# Altium schematic sheet Adafruit Feather M0 Basic rev C.SchDoc
size 282 x 200 mm; COMPANY: ADAFRUIT INDUSTRIES; DRAWN: KTOWN; REV: B
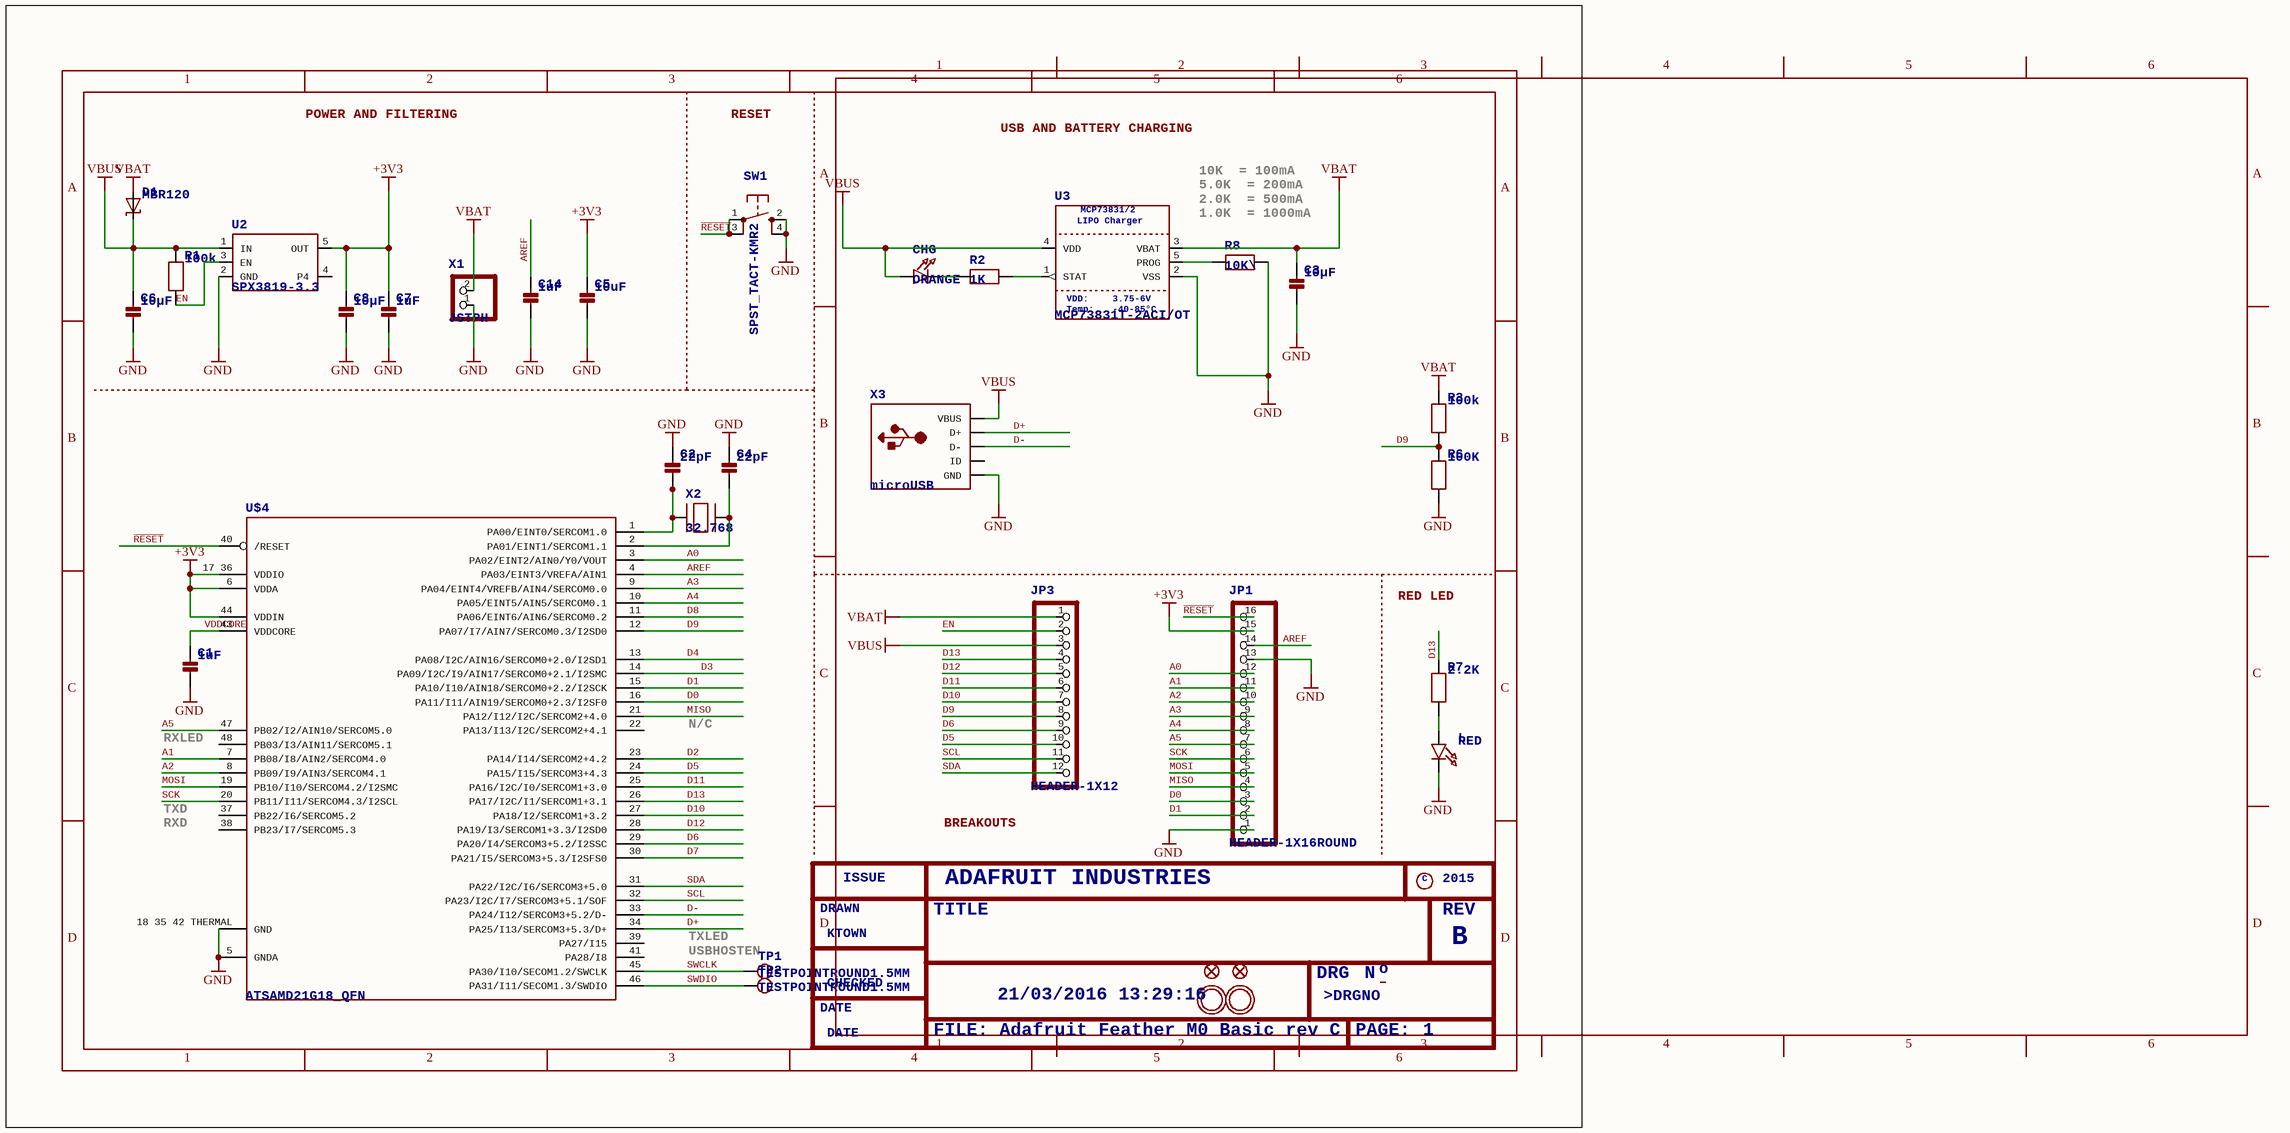
[diagram p0: Adafruit Feather M0 Basic rev C.SchDoc]

## Parts
C1  1uF  [0603-NO]
C2  22pF  [0603-NO]
C3  10µF  [0805-NO]
C4  22pF  [0603-NO]
C5  10uF  [0805-NO]
C6  10µF  [0805-NO]
C7  1uF  [0603-NO]
C8  10µF  [0805-NO]
C14  1uF  [0603-NO]
CHG  ORANGE  [CHIPLED_0805_NOOUTLINE]
D1  MBR120  [SOD-123]
FRAME1  FRAME_A4  (value not drawn)  (parts A,B of 2)
JP1  HEADER-1X16ROUND  [1X16_ROUND]
JP3  HEADER-1X12  [1X12_ROUND]
L  RED  [CHIPLED_0805_NOOUTLINE]
R1  100k  [0603-NO]
R2  1K  [0603-NO]
R3  100k  [0603-NO]
R6  100K  [0603-NO]
R7  2.2K  [0603-NO]
R8  10K\  [0603-NO]
SW1  SPST_TACT-KMR2  [KMR2]
TP1  TESTPOINTROUND1.5MM  [TESTPOINT_ROUND_1.5MM]
TP2  TESTPOINTROUND1.5MM  [TESTPOINT_ROUND_1.5MM]
U2  SPX3819-3.3  [SOT23-5]
U3  MCP73831T-2ACI/OT  LIPOCharger: LIPO Charger  Temp: Temp:  VDD: VDD:  [SOT23-5]
U$4  ATSAMD21G18_QFN  [TQFN48_7MM]
U$31  MOUNTINGHOLE2.5  [MOUNTINGHOLE_2.5_PLATED]  (value not drawn)
U$32  MOUNTINGHOLE2.5  [MOUNTINGHOLE_2.5_PLATED]  (value not drawn)
U$34  FIDUCIAL""  [FIDUCIAL_1MM]  (value not drawn)
U$35  FIDUCIAL""  [FIDUCIAL_1MM]  (value not drawn)
X1  JSTPH  [JSTPH2]
X2  32.768  [XTAL3215]
X3  microUSB  [4UCONN_20329_V2]

## Nets
+3V3: C5.1 C7.1 C8.1 JP1.15 U2.5(OUT) U$4.6(VDDA) U$4.17_36(VDDIO) U$4.44(VDDIN)
GND: C1.2 C2.2 C3.2 C4.2 C5.2 C6.2 C7.2 C8.2 C14.2 JP1.1 JP1.13 L.C R6.2 R8.2 SW1.2(S) SW1.4(S1) U2.2(GND) U3.2(VSS) U$4.5(GNDA) U$4.18_35_42_THERMAL(GND) X1.1 X3.BASE@1_BASE@2_GND_SPRT@1_SPRT@2_SPRT@3_SPRT@4(GND)
VBAT: C3.1 D1.A JP3.1 R3.1 U3.3(VBAT) X1.2
VBUS: C6.1 CHG.A D1.C JP3.3 R1.1 U2.1(IN) U3.4(VDD) X3.VBUS
A0: JP1.12 U$4.3(PA02/EINT2/AIN0/Y0/VOUT)
A1: JP1.11 U$4.7(PB08/I8/AIN2/SERCOM4.0)
A2: JP1.10 U$4.8(PB09/I9/AIN3/SERCOM4.1)
A3: JP1.9 U$4.9(PA04/EINT4/VREFB/AIN4/SERCOM0.0)
A4: JP1.8 U$4.10(PA05/EINT5/AIN5/SERCOM0.1)
A5: JP1.7 U$4.47(PB02/I2/AIN10/SERCOM5.0)
AREF: C14.1 JP1.14 U$4.4(PA03/EINT3/VREFA/AIN1)
D0: JP1.3 U$4.16(PA11/I11/AIN19/SERCOM0+2.3/I2SF0)
D1: JP1.2 U$4.15(PA10/I10/AIN18/SERCOM0+2.2/I2SCK)
D2: U$4.23(PA14/I14/SERCOM2+4.2)
D3: U$4.14(PA09/I2C/I9/AIN17/SERCOM0+2.1/I2SMC)
D4: U$4.13(PA08/I2C/AIN16/SERCOM0+2.0/I2SD1)
D5: JP3.10 U$4.24(PA15/I15/SERCOM3+4.3)
D6: JP3.9 U$4.29(PA20/I4/SERCOM3+5.2/I2SSC)
D7: U$4.30(PA21/I5/SERCOM3+5.3/I2SFS0)
D8: U$4.11(PA06/EINT6/AIN6/SERCOM0.2)
D9: JP3.8 R3.2 R6.1 U$4.12(PA07/I7/AIN7/SERCOM0.3/I2SD0)
D10: JP3.7 U$4.27(PA18/I2/SERCOM1+3.2)
D11: JP3.6 U$4.25(PA16/I2C/I0/SERCOM1+3.0)
D12: JP3.5 U$4.28(PA19/I3/SERCOM1+3.3/I2SD0)
D13: JP3.4 R7.1 U$4.26(PA17/I2C/I1/SERCOM1+3.1)
D+: U$4.34(PA25/I13/SERCOM3+5.3/D+) X3.D+
D-: U$4.33(PA24/I12/SERCOM3+5.2/D-) X3.D-
EN: JP3.2 R1.2 U2.3(EN)
MISO: JP1.4 U$4.21(PA12/I12/I2C/SERCOM2+4.0)
MOSI: JP1.5 U$4.19(PB10/I10/SERCOM4.2/I2SMC)
~{RESET}: JP1.16 SW1.1(P) SW1.3(P1) U$4.40(/RESET)
SCK: JP1.6 U$4.20(PB11/I11/SERCOM4.3/I2SCL)
SCL: JP3.11 U$4.32(PA23/I2C/I7/SERCOM3+5.1/SOF)
SDA: JP3.12 U$4.31(PA22/I2C/I6/SERCOM3+5.0)
SWCLK: TP1.P$1 U$4.45(PA30/I10/SECOM1.2/SWCLK)
SWDIO: TP2.P$1 U$4.46(PA31/I11/SECOM1.3/SWDIO)
VDDCORE: C1.1 U$4.43(VDDCORE)
NetC2_1: C2.1 U$4.1(PA00/EINT0/SERCOM1.0) X2.P$1
NetC4_1: C4.1 U$4.2(PA01/EINT1/SERCOM1.1) X2.P$2
NetCHG_C: CHG.C R2.1
NetL_A: L.A R7.2
NetR2_2: R2.2 U3.1(STAT)
NetR8_1: R8.1 U3.5(PROG)

Not connected (* = marked no-connect by the designer): U2 4(P4); U$4 22(PA13/I13/I2C/SERCOM2+4.1) 37(PB22/I6/SERCOM5.2) 38(PB23/I7/SERCOM5.3) 39(PA27/I15) 41(PA28/I8) 48(PB03/I3/AIN11/SERCOM5.1); X3 ID

## Notes on the sheet
- POWER AND FILTERING
- RESET
- USB AND BATTERY CHARGING
- 10K  = 100mA
- 5.0K  = 200mA
- 2.0K  = 500mA
- 1.0K  = 1000mA
- RED LED
- N/C
- RXLED
- TXD
- RXD
- BREAKOUTS
- TXLED
- USBHOSTEN
- (in symbol FRAME_A4, part A) 1; 2; 3; 4; 5; 6; A; C; D
- (in symbol FRAME_A4, part B) 2; 3; 4; 5; 6; A; D

## Library data of the parts
C1 C2 C4 C7 C14 = CAP_CERAMIC0603_NO: Ceramic Capacitors   For new designs, use the packages preceded by an '_' character since they are more reliable:   The following footprints should be used on most boards: _0402 - Standard footprint for regular board layouts  _0603 - Standard footprint for regular board layouts  _0805 - Standard footprint for regular board layouts  _1206 - Standard footprint for regular board layouts       For extremely tight-pitch boards where space is at a premium, the following 'micro-pitch' footprints can be used (smaller pads, no silkscreen outline, etc.): _0402MP - Micro-pitch footprint for very dense/compact boards  _0603MP - Micro-pitch footprint for very dense/compact boards  _0805MP - Micro-pitch footprint for very dense/compact boards  _1206MP - Micro-pitch footprint for very dense/compact boards; COMPANY: ADAFRUIT INDUSTRIES; DRAWN: KTOWN; REV: B
C3 C5 C6 C8 = CAP_CERAMIC0805-NOOUTLINE: Ceramic Capacitors   For new designs, use the packages preceded by an '_' character since they are more reliable:   The following footprints should be used on most boards: _0402 - Standard footprint for regular board layouts  _0603 - Standard footprint for regular board layouts  _0805 - Standard footprint for regular board layouts  _1206 - Standard footprint for regular board layouts       For extremely tight-pitch boards where space is at a premium, the following 'micro-pitch' footprints can be used (smaller pads, no silkscreen outline, etc.): _0402MP - Micro-pitch footprint for very dense/compact boards  _0603MP - Micro-pitch footprint for very dense/compact boards  _0805MP - Micro-pitch footprint for very dense/compact boards  _1206MP - Micro-pitch footprint for very dense/compact boards; COMPANY: ADAFRUIT INDUSTRIES; DRAWN: KTOWN; REV: B
CHG L = LED0805_NOOUTLINE: LED0603 - 0603 Surface Mount Package    2mA: Green LED - Low Power (3.9mcd, 2ma, 1.7Vf) - Digikey: 475-2709-2-ND  Orange LED - Low Power (9.8mcd, 2ma, 1.8Vf) - Digikey: 475-1194-2-ND  Red LED - Low Power (5mcd, 2ma, 1.8Vf) - Digikey: 475-1195-2-ND  Yellow LED - Low Power (7mcd, 2ma, 1.8Vf) - Digikey: 475-1196-2-ND       5mA: Blue LED - Low Power (17mcd, 5ma, 2.9Vf) - Digikey: LNJ937W8CRACT-ND    0805 - 0805 Surface Mount Package    2mA: Red LED (8.8mcd, 2mA, 1.8Vf, Clear) - Low Power [Digikey: 475-2510-1-ND]  Green LED (5mcd, 2mA, 1.8Vf, Clear) - Low Power [Digikey: 475-2730-1-ND]  Yellow LED (11.3mcd, 2mA, 1.8Vf, Clear) - Low Power [Digikey: 475-2555-1-ND]       20mA: Red LED (104mcd, 20mA, Diffused) - LS R976 [Digikey: 475-1278-6-ND]  Red LED (12mcd, 20mA, 2.0Vf, Clear) - APT2012EC [Digikey: 754-1128-1-ND]  Green LED (15mcd, 20mA, 2.2Vf, Clear) - APT2012GC [Digikey: 754-1131-1-ND]  Orange LED (160mcd, 20mA, 2.1Vf, Clear) - APT2012SECK [Digikey: 754-1130-1-ND]     1206 - 1206 Surface Mount Package  Green LED (26mcd, 20mA, Diffused) - LG N971  [Digikey: 475-1407-6-ND]  Red LED (15mcd, 20mA, Diffused) - LH N974 [Digikey: 475-1416-6-ND]     Cree - Cree High-Power Surface Mount LEDs  XPEBWT-L1-0000-00D50 - White 111lm 350mA 2.9Vf 6200K 110°  XTEAWT-00-0000-00000LEE3 - White 114lm 350mA 2.85Vf 5000K 115°     Everlight - Everlight 45-21 Series Surface Mount LEDs  45-21/QK2C-B2832AC2CB2/2T - Warm White 2000mcd 20mA 3.25Vf 3050K 120°  45-21/LK2C-B38452C4CB2/2T - Nuetral White 2000mcd 20mA 3.25Vf 4150K 120°  45-21/LK2C-B50634C6CB2/2T - Cold White 2200mcd 20mA 3.25Vf 5650K 120°     PLCC2 Reverse Mount LS T77K-J1L2-1-0-2-R18-Z - Red 11.25mcd 2mA 1.8Vf 630nm 120°  LO T77K-L1M2-24-Z - Orange 19.6mcd 2mA 1.8Vf 606nm 120°  LY T77K-K2M1-26-Z - Yellow 15.7mcd 2mA 1.8Vf 587nm 120°; COMPANY: ADAFRUIT INDUSTRIES; DRAWN: KTOWN; REV: B
D1 = DIODE-SCHOTTKYSOD-123: COMPANY: ADAFRUIT INDUSTRIES; DRAWN: KTOWN; REV: B
FRAME1 = FRAME_A4: FRAME   DIN A4, landscape with location and doc. field; COMPANY: ADAFRUIT INDUSTRIES; DRAWN: KTOWN; REV: B
JP1 = HEADER-1X16ROUND: PIN HEADER; COMPANY: ADAFRUIT INDUSTRIES; DRAWN: KTOWN; REV: B
JP3 = HEADER-1X12: COMPANY: ADAFRUIT INDUSTRIES; DRAWN: KTOWN; REV: B
R1-R3 R6-R8 = RESISTOR_0603_NOOUT: Resistors   For new designs, use the packages preceded by an '_' character since they are more reliable:   The following footprints should be used on most boards: _0402 - Standard footprint for regular board layouts  _0603 - Standard footprint for regular board layouts  _0805 - Standard footprint for regular board layouts  _1206 - Standard footprint for regular board layouts       For extremely tight-pitch boards where space is at a premium, the following 'micro-pitch' footprints can be used (smaller pads, no silkscreen outline, etc.): _0402MP - Micro-pitch footprint for very dense/compact boards  _0603MP - Micro-pitch footprint for very dense/compact boards  _0805MP - Micro-pitch footprint for very dense/compact boards  _1206MP - Micro-pitch footprint for very dense/compact boards; COMPANY: ADAFRUIT INDUSTRIES; DRAWN: KTOWN; REV: B
SW1 = SPST_TACT-KMR2: SMT 6mm switch, EVQQ2 series    http://www.ladyada.net/library/eagle
TP1 TP2 = TESTPOINTROUND1.5MM: Test Point   Various test points for characterisation and PCB testing    TESTPOINT_SMT - Compact Surface Mount Test Point [Digikey: 5016KTR-ND]; COMPANY: ADAFRUIT INDUSTRIES; DRAWN: KTOWN; REV: B
U2 = VREG_SOT23-5: SOT23-5 Fixed Voltage Regulators      Part	Current Out	V Out	V In	V Dropout	θJA (°C/W)	TJ (°C)	Digikey Part No.	     ADP121	  150mA	  3.3V	  3.4-5.5V	  0.09V @ 150mA	  --	  --	  ADP121-AUJZ33R7CT-ND	     ADP121	  150mA	  3.0V	  3.1-5.5V	  0.09V @ 150mA	  --	  --	  ADP121-AUJZ30R7CT-ND	     ADP122	  300mA	  3.3V	  3.4-5.5V	  0.085V @ 300mA	  --	  --	  ADP122AUJZ-3.3-R7CT-ND	     ADP1712	  300mA	  3.3V	  3.5-5.5V	  0.17V @ 300mA	  --	  --	  ADP1712AUJZ-3.3-R7TR-ND	     AP7311 (Low Cost)	  150mA	  3.3V	  3.5-6V	  0.15V @ 150mA	  --	  --	  AP7311-33WG-7DICT-ND	     LD39015M18R	  150mA	  1.8V	  1.9V-5.5V	  0.08V @ 100mA	  --	  --	  497-6977-1-ND	     LP2985A-33DBVR	  150mA	  3.3V	  3.3-16V	  0.28V @ 150mA	  206	  150	  296-18479-1-ND	     MCP1824T-3302E/OT	  300mA	  3.3V	  3.5V-6V	  0.2V @ 300mA	  --	  --	  MCP1824T-3302E/OTCT-ND	     MIC5205-2.5YM5 TR	  150mA	  2.5V	  2.7-16V	  0.165V @ 150mA	  --	  --	  576-1257-2-ND	     MIC5205-3.0YM5 TR	  150mA	  3.0V	  3.2V-16V	  0.165V @ 150mA	  --	  --	  576-1258-2-ND	     MIC5205-3.3YM5 TR	  150mA	  3.3V	  3.5V-16V	  0.165V @ 150mA	  --	  --	  576-1259-2-ND	     TPS780330220	  150mA	  3.3V+2.2V	  3.6-5.5V	  250mV Max	  --	  --	  296-23332-1-ND	     TDA3663/N1,135	  100mA	  3.3V	  3.5-45V	  0.18V @ 50mA	  --	  --	  568-5343-1-ND	     	  	  	  	  	  	  	  	     	  	  	  	  	  	  	  	   Max operating temp can be calculated using θJA, TJ (max junction temperature), and power in watts.  Set the "Maximum Ambient Temperature" until it reaches TJ ("Max Junction Temperature"), which is the absolute limit for safe use of the regulator: Heat Sink Temperature Calculator   For example, With 12V source into a 3.3V LP2985 and a 30mA load, we are dissipating (12V-3.3V) * 0.03A = 0.261W.  With a θJA of 206 °C/W, a TJ of 150°C, and 261mW we can safely use the chip without a heat sink up to 75°C (=147.1°C Junction Temperature).; COMPANY: ADAFRUIT INDUSTRIES; DRAWN: KTOWN; REV: B
U3 = MCP73831/2: MCP73831/2 LIPO Charger    VDD: 3.75 - 6V  Temp -40 - 85°C  Programmable Charge Rate: 15-500mA       NOTE: STAT is a tri-state logic output on the MCP73831 and an open-drain output on the MCP73832.   SOT23-5 with 4.2V output and tri-state logic on STAT = MCP73831T-2ACI/OT; COMPANY: ADAFRUIT INDUSTRIES; DRAWN: KTOWN; REV: B; MCP73831/2: MCP73831/2; -40-85°C: -40-85°C; 3.75-6V: 3.75-6V
U$4 = ATSAMD21J_QFN: COMPANY: ADAFRUIT INDUSTRIES; DRAWN: KTOWN; REV: B
U$31 U$32 = MOUNTINGHOLE2.5: Mounting Hole   For #2 screws (0.086"/2.18mm width, 0.094"/2.4mm hole) use 2.5mm; BOM: EXCLUDE; COMPANY: ADAFRUIT INDUSTRIES; DRAWN: KTOWN; REV: B
U$34 U$35 = FIDUCIAL"": Fiducial Alignment Points   Various fiducial points for machine vision alignment.; BOM: EXCLUDE; COMPANY: ADAFRUIT INDUSTRIES; DRAWN: KTOWN; REV: B
X1 = CON_JST_PH_2PIN: JST 2-Pin Right-Angle Connector  PH-Series - 4UConnector: 17311  SH-Series - 4UConnector: 07278; COMPANY: ADAFRUIT INDUSTRIES; DRAWN: KTOWN; REV: B
X2 = XTAL-3.2X1.5: Low cost SMT crystals, no capacitors included    http://www.ladyada.net/library/eagle; COMPANY: ADAFRUIT INDUSTRIES; DRAWN: KTOWN; REV: B
X3 = USB_MICRO_20329_V2: USB ConnectorsUSBMINIB - Surface Mount Female Mini-B USB Connector    4UConnector: 06564; COMPANY: ADAFRUIT INDUSTRIES; DRAWN: KTOWN; REV: B